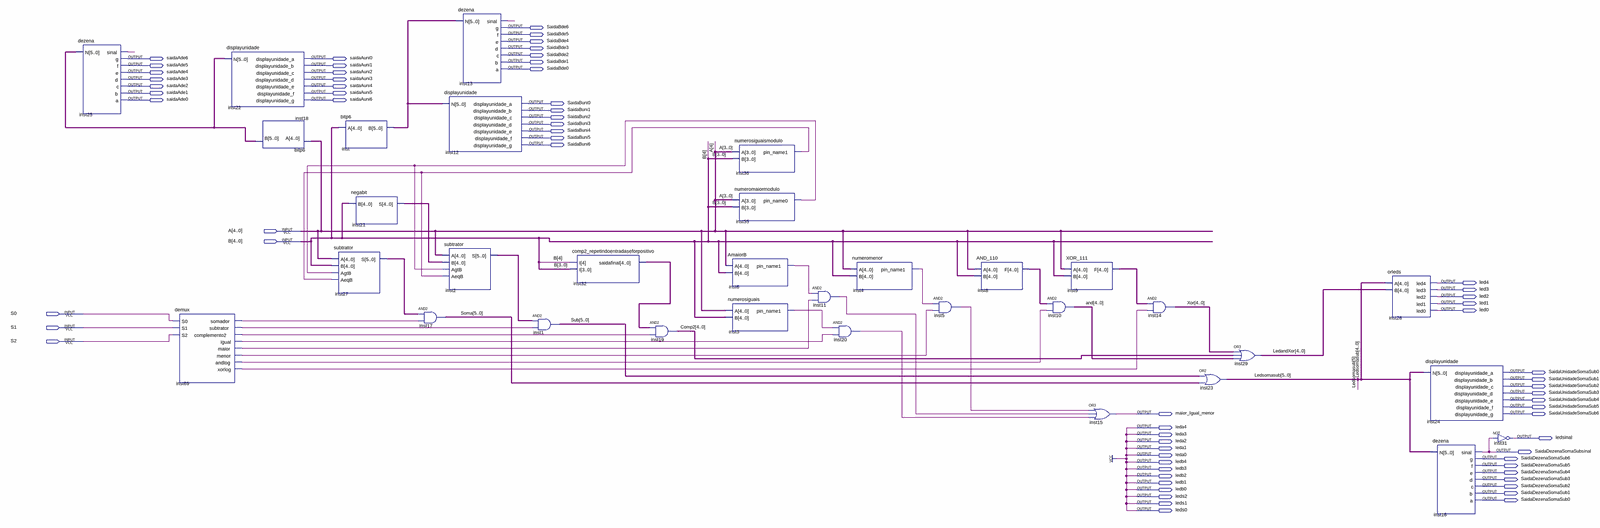
[diagram p0: schematic sheet, whole]
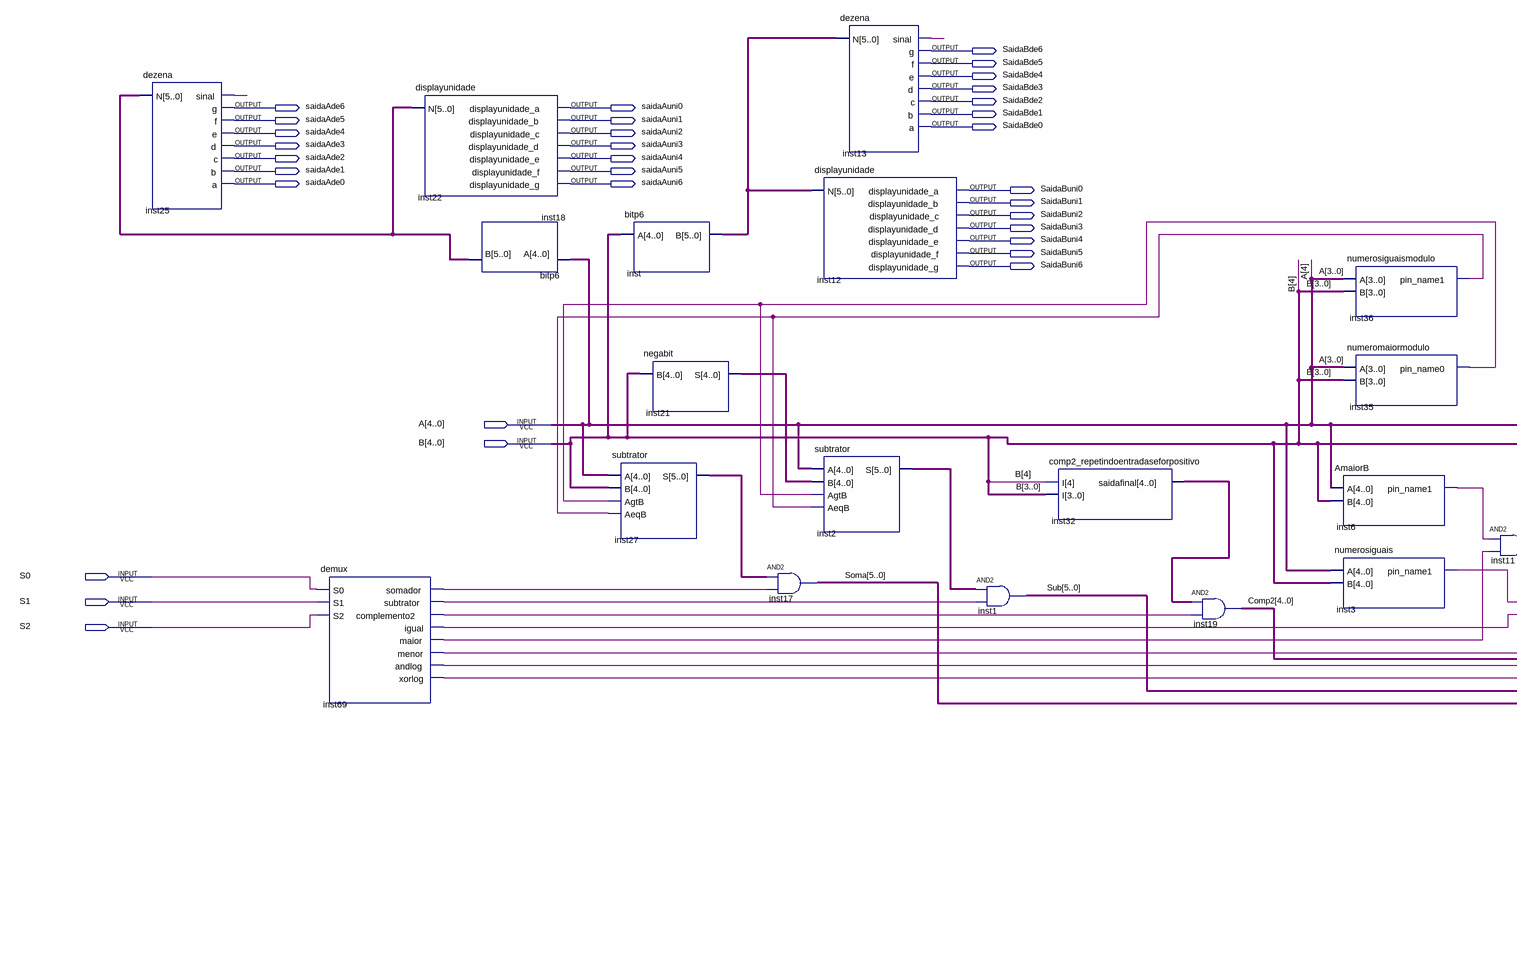
[diagram p1: schematic sheet, left part]
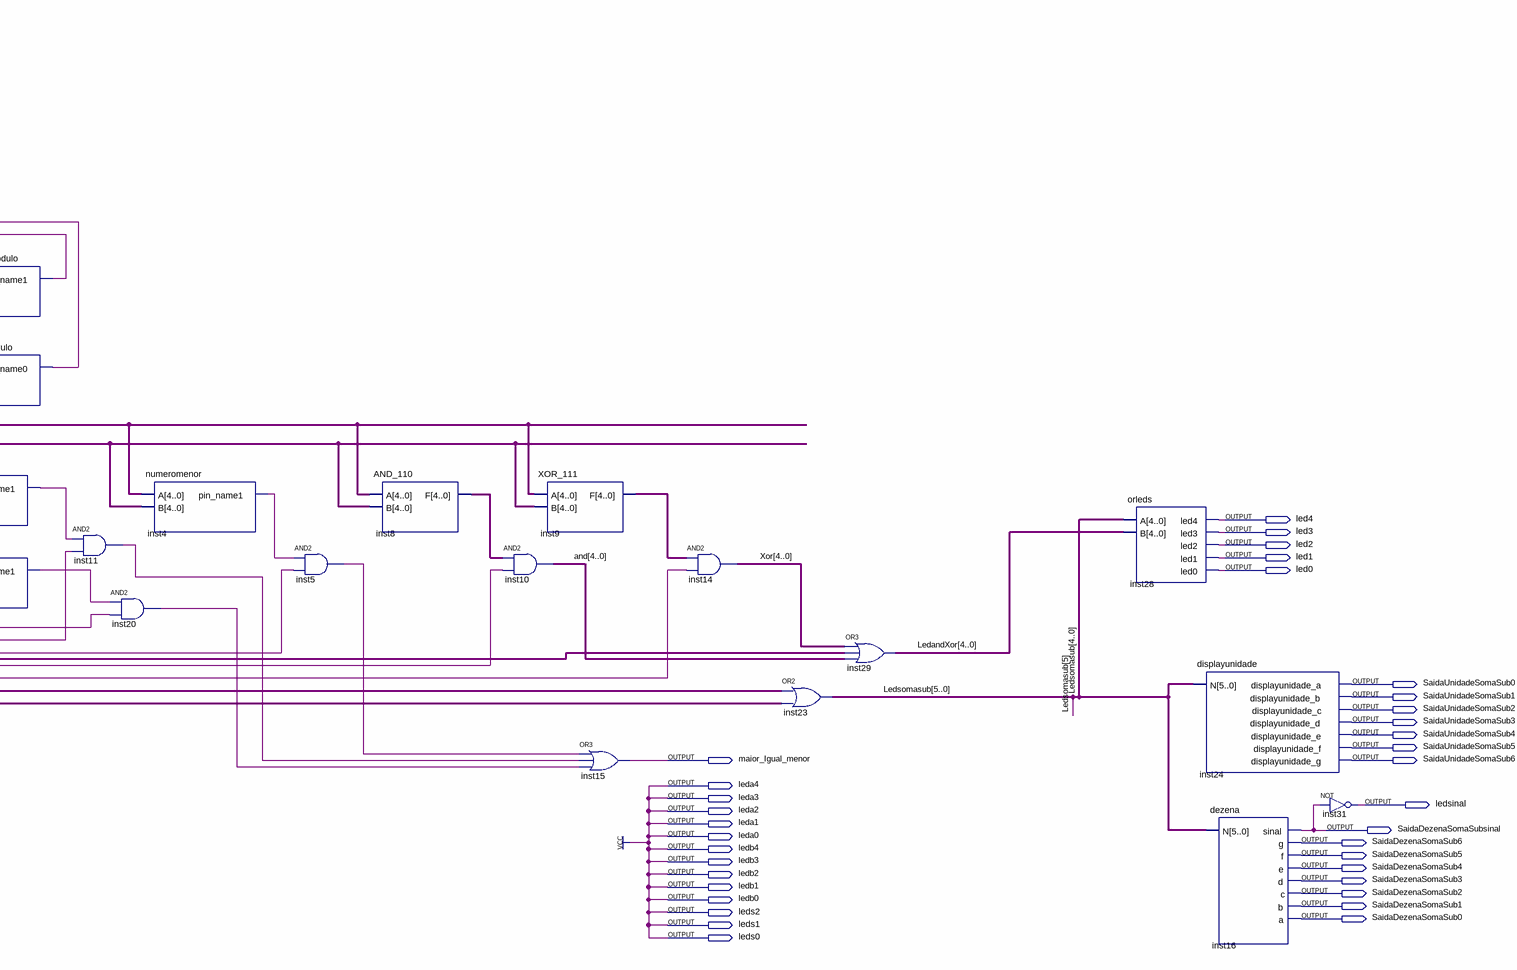
[diagram p2: schematic sheet, right part]
// Quartus schematic arquiteturageral.bdf as structural Verilog: 33 symbols, 68 pins
module arquiteturageral (
  input  [4:0] A,
  input  [4:0] B,
  input  S0,
  input  S1,
  input  S2,
  output SaidaBde6,
  output SaidaBde5,
  output SaidaBde4,
  output SaidaBde3,
  output SaidaBde2,
  output saidaAde6,
  output saidaAuni0,
  output SaidaBde1,
  output saidaAde5,
  output saidaAuni1,
  output SaidaBde0,
  output saidaAde4,
  output saidaAuni2,
  output saidaAde3,
  output saidaAuni3,
  output saidaAde2,
  output saidaAuni4,
  output saidaAde1,
  output saidaAuni5,
  output saidaAde0,
  output saidaAuni6,
  output SaidaBuni0,
  output SaidaBuni1,
  output SaidaBuni2,
  output SaidaBuni3,
  output SaidaBuni4,
  output SaidaBuni5,
  output SaidaBuni6,
  output led4,
  output led3,
  output led2,
  output led1,
  output led0,
  output SaidaUnidadeSomaSub0,
  output SaidaUnidadeSomaSub1,
  output SaidaUnidadeSomaSub2,
  output SaidaUnidadeSomaSub3,
  output SaidaUnidadeSomaSub4,
  output SaidaUnidadeSomaSub5,
  output maior_Igual_menor,
  output SaidaUnidadeSomaSub6,
  output leda4,
  output leda3,
  output ledsinal,
  output leda2,
  output leda1,
  output SaidaDezenaSomaSubsinal,
  output leda0,
  output SaidaDezenaSomaSub6,
  output ledb4,
  output SaidaDezenaSomaSub5,
  output ledb3,
  output SaidaDezenaSomaSub4,
  output ledb2,
  output SaidaDezenaSomaSub3,
  output ledb1,
  output SaidaDezenaSomaSub2,
  output ledb0,
  output SaidaDezenaSomaSub1,
  output leds2,
  output SaidaDezenaSomaSub0,
  output leds1,
  output leds0
);

  wire inst3_pin_name1, inst4_pin_name1, inst5_out, inst6_pin_name1, inst11_out, inst13_sinal, inst20_out,
       inst25_sinal, inst35_pin_name0, inst36_pin_name1, inst69_andlog, inst69_complemento2, inst69_igual,
       inst69_maior, inst69_menor, inst69_somador, inst69_subtrator, inst69_xorlog;
  wire [4:0] \and , Comp2, inst8_f, inst9_f, inst21_s, inst32_saidafinal, LedandXor, Xor;
  wire [5:0] inst2_s, inst18_b, inst27_s, inst_b, Ledsomasub, Soma, Sub;

  dezena inst25 (
    .N(inst18_b), .sinal(inst25_sinal), .g(saidaAde6), .f(saidaAde5), .e(saidaAde4), .d(saidaAde3),
    .c(saidaAde2), .b(saidaAde1), .a(saidaAde0));
  demux inst69 (
    .S0(S0), .S1(S1), .S2(S2), .somador(inst69_somador), .subtrator(inst69_subtrator),
    .complemento2(inst69_complemento2), .igual(inst69_igual), .maior(inst69_maior), .menor(inst69_menor),
    .andlog(inst69_andlog), .xorlog(inst69_xorlog));
  displayunidade inst22 (
    .N(inst18_b), .displayunidade_a(saidaAuni0), .displayunidade_b(saidaAuni1),
    .displayunidade_c(saidaAuni2), .displayunidade_d(saidaAuni3), .displayunidade_e(saidaAuni4),
    .displayunidade_f(saidaAuni5), .displayunidade_g(saidaAuni6));
  bitp6 inst18 (.A(A), .B(inst18_b));
  subtrator inst27 (.A(A), .B(B), .AgtB(inst35_pin_name0), .AeqB(inst36_pin_name1), .S(inst27_s));
  bitp6 inst (.A(B), .B(inst_b));
  negabit inst21 (.B(B), .S(inst21_s));
  assign Soma = inst27_s & {6{inst69_somador}};  // AND2 inst17, 6 bits wide
  displayunidade inst12 (
    .N(inst_b), .displayunidade_a(SaidaBuni0), .displayunidade_b(SaidaBuni1), .displayunidade_c(SaidaBuni2),
    .displayunidade_d(SaidaBuni3), .displayunidade_e(SaidaBuni4), .displayunidade_f(SaidaBuni5),
    .displayunidade_g(SaidaBuni6));
  subtrator inst2 (.A(A), .B(inst21_s), .AgtB(inst35_pin_name0), .AeqB(inst36_pin_name1), .S(inst2_s));
  dezena inst13 (
    .N(inst_b), .sinal(inst13_sinal), .g(SaidaBde6), .f(SaidaBde5), .e(SaidaBde4), .d(SaidaBde3),
    .c(SaidaBde2), .b(SaidaBde1), .a(SaidaBde0));
  assign Sub = inst2_s & {6{inst69_subtrator}};  // AND2 inst1, 6 bits wide
  comp2_repetindoentradaseforpositivo inst32 (.I(B), .saidafinal(inst32_saidafinal));
  assign Comp2 = inst32_saidafinal & {5{inst69_complemento2}};  // AND2 inst19, 5 bits wide
  numerosiguaismodulo inst36 (.A(A[3:0]), .B(B[3:0]), .pin_name1(inst36_pin_name1));
  numeromaiormodulo inst35 (.A(A[3:0]), .B(B[3:0]), .pin_name0(inst35_pin_name0));
  AmaiorB inst6 (.A(A), .B(B), .pin_name1(inst6_pin_name1));
  numerosiguais inst3 (.A(A), .B(B), .pin_name1(inst3_pin_name1));
  and inst11 (inst11_out, inst6_pin_name1, inst69_maior);
  and inst20 (inst20_out, inst3_pin_name1, inst69_igual);
  numeromenor inst4 (.A(A), .B(B), .pin_name1(inst4_pin_name1));
  and inst5 (inst5_out, inst4_pin_name1, inst69_menor);
  AND_110 inst8 (.A(A), .B(B), .F(inst8_f));
  assign \and  = inst8_f & {5{inst69_andlog}};  // AND2 inst10, 5 bits wide
  XOR_111 inst9 (.A(A), .B(B), .F(inst9_f));
  or inst15 (maior_Igual_menor, inst5_out, inst11_out, inst20_out);
  assign Xor = inst9_f & {5{inst69_xorlog}};  // AND2 inst14, 5 bits wide
  assign Ledsomasub = Sub | Soma;  // OR2 inst23, 6 bits wide
  assign LedandXor = Xor | Comp2 | \and ;  // OR3 inst29, 5 bits wide
  orleds inst28 (.A(Ledsomasub[4:0]), .B(LedandXor), .led4(led4), .led3(led3), .led2(led2), .led1(led1), .led0(led0));
  displayunidade inst24 (
    .N(Ledsomasub), .displayunidade_a(SaidaUnidadeSomaSub0), .displayunidade_b(SaidaUnidadeSomaSub1),
    .displayunidade_c(SaidaUnidadeSomaSub2), .displayunidade_d(SaidaUnidadeSomaSub3),
    .displayunidade_e(SaidaUnidadeSomaSub4), .displayunidade_f(SaidaUnidadeSomaSub5),
    .displayunidade_g(SaidaUnidadeSomaSub6));
  dezena inst16 (
    .N(Ledsomasub), .sinal(SaidaDezenaSomaSubsinal), .g(SaidaDezenaSomaSub6), .f(SaidaDezenaSomaSub5),
    .e(SaidaDezenaSomaSub4), .d(SaidaDezenaSomaSub3), .c(SaidaDezenaSomaSub2), .b(SaidaDezenaSomaSub1),
    .a(SaidaDezenaSomaSub0));
  not inst31 (ledsinal, SaidaDezenaSomaSubsinal);

  assign leda0 = 1'b1;
  assign leda1 = 1'b1;
  assign leda2 = 1'b1;
  assign leda3 = 1'b1;
  assign leda4 = 1'b1;
  assign ledb0 = 1'b1;
  assign ledb1 = 1'b1;
  assign ledb2 = 1'b1;
  assign ledb3 = 1'b1;
  assign ledb4 = 1'b1;
  assign leds0 = 1'b1;
  assign leds1 = 1'b1;
  assign leds2 = 1'b1;
endmodule
